# Altium schematic sheet 12V_9V_Power_Stage.SchDoc (part 1 of 4)
size 431 x 279 mm; Organization: ORGANIZATION; Address1: ADDRESS 1; Address2: ADDRESS 2; Address3: ADDRESS 3; Address4: ADDRESS 4; Revision: -; SheetNumber: 4; SheetTotal: 6; ENG_APP_DATE: --/--/--; DSN_APP_DATE: --/--/--; CHK_APP_DATE: --/--/--
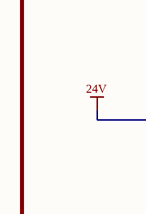
[diagram p0: 12V_9V_Power_Stage.SchDoc, left]
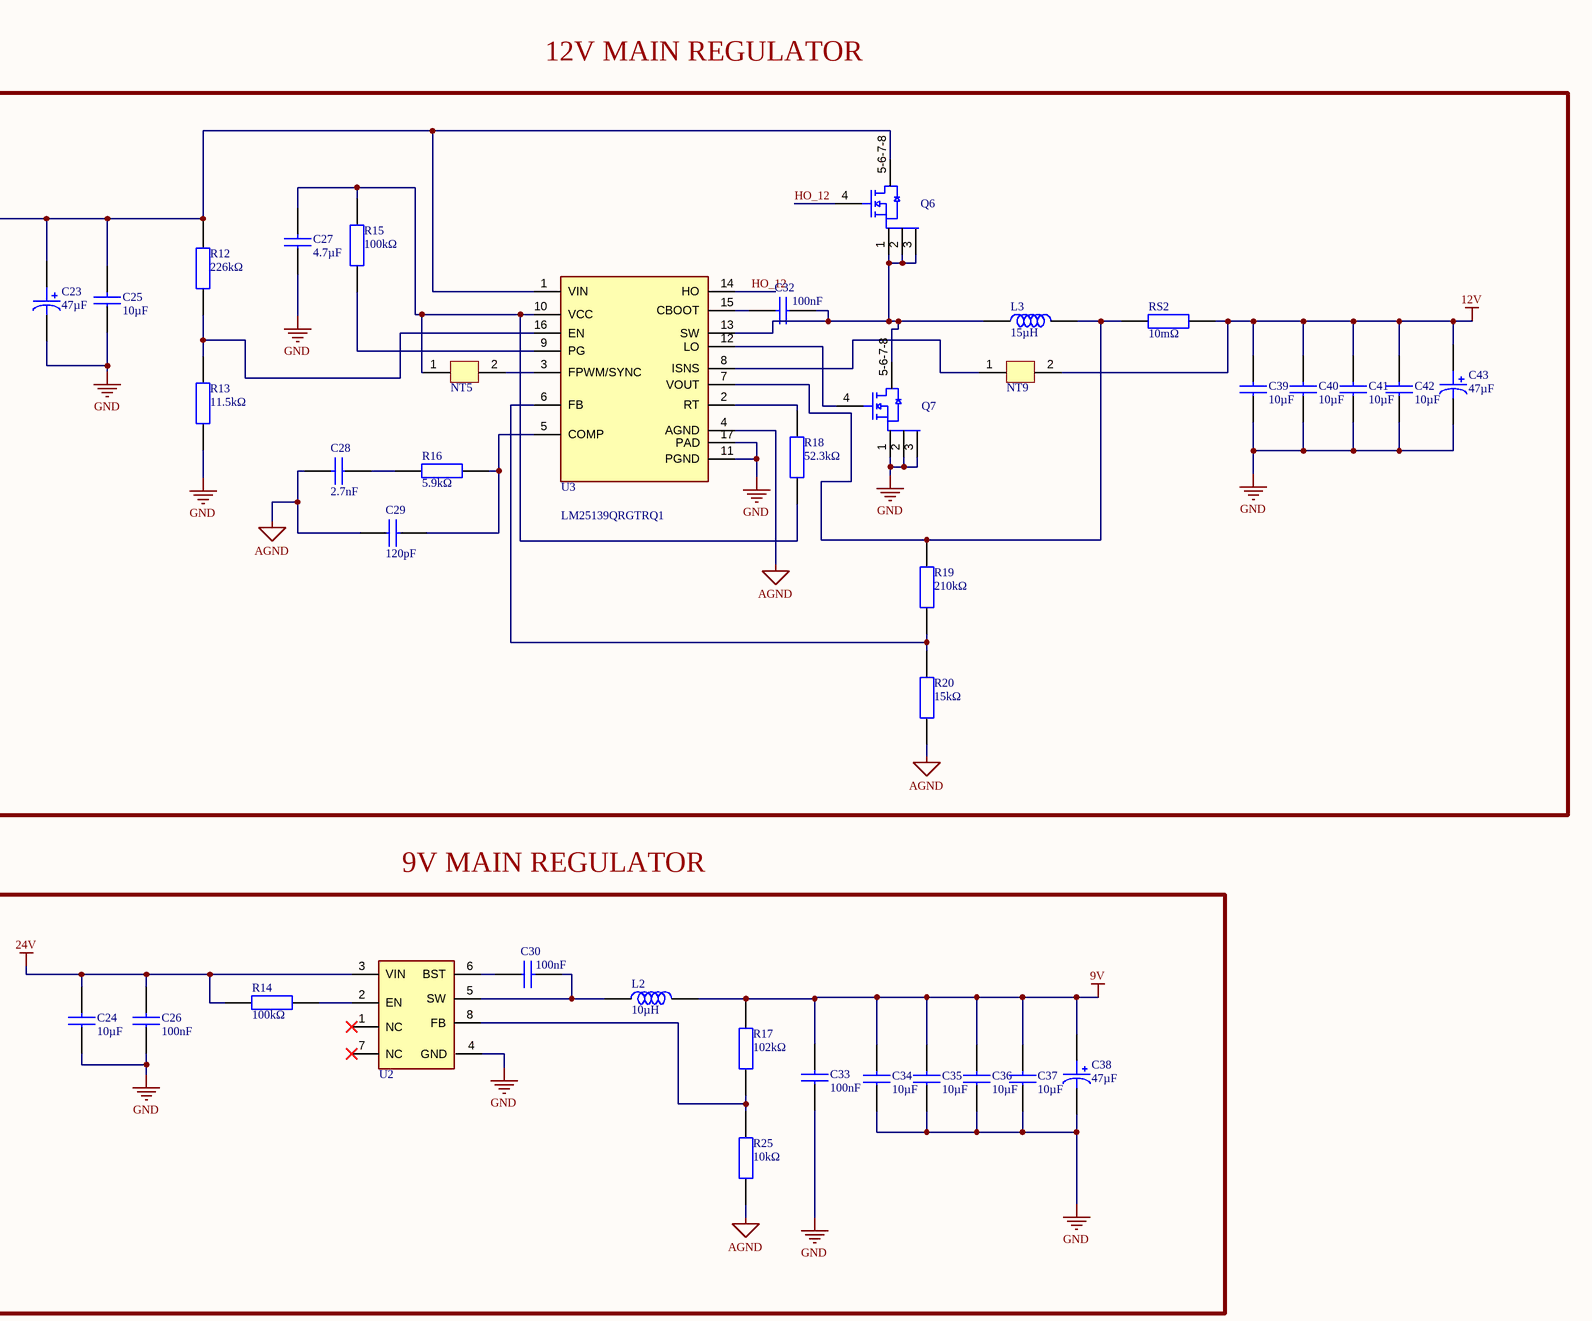
[diagram p1: 12V_9V_Power_Stage.SchDoc, right]

## Parts
C23  value 47µF  [CAP ALUM SMD]  (hidden comment: EEHZA1H470P)
C24  value 10µF  [CAP_1210_S]  (hidden comment: CL32A106KBJNNNE)
C25  value 10µF  [CAP_1206]  (hidden comment: C3216X7R1H106K160AC)
C26  value 100nF  [CAP_0603]  (hidden comment: CGA3E2X7R1H104K080AA)
C27  value 4.7µF  [CAP_0805]  (hidden comment: LMK212B7475KG-T)
C28  value 2.7nF  [CAP_0603]  (hidden comment: GRM1885C1H272JA01J)
C29  value 120pF  [CAP_0402]  (hidden comment: UMK105CG121JV-F)
C30  value 100nF  [CAP_0402]  (hidden comment: C0603X5R1A104K030BC)
C32  value 100nF  [CAP_0402]  (hidden comment: GRM155R71A104KA01D)
C33  value 100nF  [CAP_0603]  (hidden comment: CGA3E2X7R1H104K080AA)
C34  value 10µF  [CAP_1206]  (hidden comment: GRM31CR71E106KA12L)
C35  value 10µF  [CAP_1206]  (hidden comment: GRM31CR71E106KA12L)
C36  value 10µF  [CAP_1206]  (hidden comment: GRM31CR71E106KA12L)
C37  value 10µF  [CAP_1206]  (hidden comment: GRM31CR71E106KA12L)
C38  value 47µF  [CAP ALUM SMD]  (hidden comment: EEHZA1H470P)
C39  value 10µF  [CAP_1206]  (hidden comment: GRM31CR71E106KA12L)
C40  value 10µF  [CAP_1206]  (hidden comment: GRM31CR71E106KA12L)
C41  value 10µF  [CAP_1206]  (hidden comment: GRM31CR71E106KA12L)
C42  value 10µF  [CAP_1206]  (hidden comment: GRM31CR71E106KA12L)
C43  value 47µF  [CAP ALUM SMD]  (hidden comment: EEHZA1H470P)
L2  value 10µH  [SRR1208]  (hidden comment: SRR1208-100ML)
L3  value 15µH  [MSS1210]  (hidden comment: MSS1210-153MED)
NT5  Net-Tie  [Net-Tie]  (value not drawn)  (net tie, no BOM)
NT9  Net-Tie  [Net-Tie]  (value not drawn)  (net tie, no BOM)
Q6  CSD18540Q5B  [SON 5X6]  (value not drawn)
Q7  CSD18540Q5B  [SON 5X6]  (value not drawn)
R12  value 226kΩ  [RES_0402]  (hidden comment: CRCW0402226KFKED)
R13  value 11.5kΩ  [RES_0402]  (hidden comment: CRCW040211K5FKED)
R14  value 100kΩ  [RES_0603]  (hidden comment: CRCW0603100KFKEA)
R15  value 100kΩ  [RES_0603]  (hidden comment: CRCW0603100KFKEA)
R16  value 5.9kΩ  [RES_0402]  (hidden comment: CRCW04025K90FKED)
R17  value 102kΩ  [RES_0402]  (hidden comment: CRCW0402102KFKED)
R18  value 52.3kΩ  [RES_0603]  (hidden comment: CRCW060352K3FKEA)
R19  value 210kΩ  [RES_0402]  (hidden comment: CRCW0402210KFKED)
R20  value 15kΩ  [RES_0402]  (hidden comment: CRCW040215K0FKED)
R25  value 10kΩ  [RES_0402]  (hidden comment: CRCW040210K0FKED)
RS2  value 10mΩ  [CAP_1206]  (hidden comment: CSR1206FK10L0)
U2  TPS563300DRLR  [SOT-583-8]  (value not drawn)
U3  LM25139QRGTRQ1  [16-VFQFN]

## Blocks framed on the sheet
9V MAIN REGULATOR: C24 C26 C30 C33-C38 L2 R14 R17 R25 U2

## Nets
9V: C33.2 C34.2 C35.2 C36.2 C37.2 C38.1(C) L2.2 R17.2
12V: C39.2 C40.2 C41.2 C42.2 C43.1(C) NT9.2 RS2.2
24V: C23.1(C) C24.2 C25.2 C26.2 Q6.5-6-7-8(D) R12.2 R14.1 U2.3(VIN) U3.1(VIN)
AGND: C28.2 C29.1 R20.1 R25.1 U3.4(AGND)
GND: C23.2(A) C24.1 C25.1 C26.1 C27.1 C33.1 C34.1 C35.1 C36.1 C37.1 C38.2(A) C39.1 C40.1 C41.1 C42.1 C43.2(A) Q7.1(S) Q7.2(S) Q7.3(S) R13.1 U2.4(GND) U3.11(PGND) U3.17(PAD)
HO_12: Q6.4(G) U3.14(HO)
NetC27_2: C27.2 NT5.1 R15.2 R18.1 U3.10(VCC)
NetC28_1: C28.1 R16.1
NetC29_2: C29.2 R16.2 U3.5(COMP)
NetC30_1: C30.1 U2.6(BST)
NetC30_2: C30.2 L2.1 U2.5(SW)
NetC32_1: C32.1 L3.1 Q6.1(S) Q6.2(S) Q6.3(S) Q7.5-6-7-8(D) U3.13(SW)
NetC32_2: C32.2 U3.15(CBOOT)
NetL3_2: L3.2 R19.2 RS2.1 U3.7(VOUT)
NetNT5_2: NT5.2 U3.3(FPWM/SYNC)
NetNT9_1: NT9.1 U3.8(ISNS)
NetQ7_4: Q7.4(G) U3.12(LO)
NetR12_1: R12.1 R13.2 U3.16(EN)
NetR14_2: R14.2 U2.2(EN)
NetR15_1: R15.1 U3.9(PG)
NetR17_1: R17.1 R25.2 U2.8(FB)
NetR18_2: R18.2 U3.2(RT)
NetR19_1: R19.1 R20.2 U3.6(FB)

Not connected (* = marked no-connect by the designer): U2 1(NC)* 7(NC)*

## Notes on the sheet
- 12V MAIN REGULATOR
- DWG. NO.
- REV.
- SHT.
- THIS DOCUMENT AND THE DATA DISCLOSED HEREIN OR HEREWITH IS THE PROPERTY OF ALTIUM LIMITED AND MAY BE FREELY DISTRIBUTED IN WHOLE. NO RIGHTS ARE RESERVED OR EXPRESS OR IMPLIED WARANTEE GIVEN.
- REVISION
- DESCRIPTION
- DATE
- APPROVED
- ENG:
- DSN:
- APPROVALS
- PROJECT REVISION:
- www.altium.com <http://www.altium.com>
- DOCUMENT REVISION:
- 92037, La Jolla
- USA
- Altium Ltd.
- 4225 Executive Square
- CHK:
- REFERENCE DOCUMENTS
- DESIGN ITEM:
- TITLE
- VARIANT
- BOM:
- FAB DWG:
- PCB DWG:
- ASSY DWG:
- SCALE:
- SIZE
- B
- CAGE CODE
- FILE NAME
- DWG NO.
- SHEET
- OF
- REV
## Library data of the parts
C23 C38 C43 = EEHZA1H470P: Conductive Polymer Hybrid Aluminum Electrolytic Capacitors, 47µF, 50V, -55 to 105¡C; Manufacturer: Panasonic; Manufacturer Part Number: EEH-ZA1H470P; Manufacturer Lifecycle Status: ACTIVE; Part Series: ZA (High temp. reflow); ESR (Equivalent Series Resistance): 30mΩ; Leakage Current: 23.5µA; Life (Hours): 10000hours; Ripple Current: 1.8A; Tolerance: 20%; Supplier: Farnell; Supplier Part Number: EEHZA1H470P; RoHS: Compliant; Category: Aluminum Electrolytic Capacitors; Stock: 93; Pricing: 1=1,14, 10=0,637, 50=0,607, 100=0,576, 200=0,528, 500=0,479 (EUR); Case/Package: 3333; Country of Origin: Japan; Diameter: 8mm; Export Control Classification Number (ECCN) Code: EAR99; Height: 10.2mm; Harmonized Tariff Schedule (HTS) Code: 8532.22.00.20; Introduction Date: 2019-05-31; Length: 10.2mm; Lifecycle Status: Production; Material: Polymer; Max Operating Temperature: 105°C; Min Operating Temperature: -55°C; Mounting Technology: Surface Mount; Number of Terminals: 2; Ratings: AEC-Q200; REACH SVHC: Yes; Voltage Rating: 50V; Voltage Rating (DC): 50V; Width: 8.3mm; ComponentLink1URL: https://datasheet.octopart.com:443/EEH-ZA1H470P-Panasonic-datasheet-68301292.pdf?src-supplier=Panasonic; ComponentLink1Description: https://datasheet.octopart.com:443/EEH-ZA1H470P-Panasonic-datasheet-68301292.pdf?src-supplier=Panasonic; ComponentLink2URL: https://datasheet.octopart.com:443/EEH-ZA1H470P-Panasonic-datasheet-136612405.pdf?src-supplier=Electro+Sonic; ComponentLink2Description: https://datasheet.octopart.com:443/EEH-ZA1H470P-Panasonic-datasheet-136612405.pdf?src-supplier=Electro+Sonic; ComponentLink3URL: https://datasheet.octopart.com:443/EEHZA1H470P-Panasonic-datasheet-137675046.pdf?src-supplier=TME; ComponentLink3Description: https://datasheet.octopart.com:443/EEHZA1H470P-Panasonic-datasheet-137675046.pdf?src-supplier=TME
C24 = CL32A106KBJNNNE: 50V 10uF X5R 卤10% 1210 Multilayer Ceramic Capacitors MLCC - SMD/SMT ROHS; Manufacturer: Samsung Electro-Mechanics; Manufacturer Package Identifier: 1210 (3225 Metric); Tolerance: 10%; Supplier: Future Electronics; Supplier Part Number: CL32A106KBJNNNE; Manufacturer Part Number: CL32A106KBJNNNE; RoHS: Compliant; Category: Ceramic Capacitors; Stock: 186000; Pricing: 1000=0,11, 3000=0,107, 10000=0,105, 15000=0,103 (USD); Case/Package: 1210; Case Code (Imperial): 1210; Case Code (Metric): 3225; China RoHS: Compliant; Country of Origin: Mainland China, Philippines, South Korea; Depth: 2.5mm; Dielectric: X5R; Dielectric Material: Ceramic; Export Control Classification Number (ECCN) Code: EAR99; Height: 2.5mm; Harmonized Tariff Schedule (HTS) Code: 8532.24.00.20; Introduction Date: 2012-02-17; Lead Free: Lead Free; Length: 3.2mm; Lifecycle Status: Production; Material: Ceramic; Max Operating Temperature: 85°C; Min Operating Temperature: -55°C; Mounting Technology: Surface Mount; Number of Terminals: 2; Packaging: Tape & Reel (TR); REACH SVHC: Yes; Schedule B: 8532240020, 8532240020|8532240020|8532240020|8532240020|8532240020|8532240020|8532240020|8532240020|8532240020|8532240020|8532240020|8532240020|8532240020|8532240020|8532240020|8532240020|8532240020|8532240020|8532240020|8532240020|8532240020|8532240020|8532240020|85; Thickness: 2.6924mm; Voltage Rating: 50V; Voltage Rating (DC): 50V; Width: 2.5mm; ComponentLink1URL: https://datasheet.octopart.com:443/CL32A106KBJNNNE-Samsung-Electro-Mechanics-datasheet-141348239.pdf?src-supplier=Newark; ComponentLink1Description: https://datasheet.octopart.com:443/CL32A106KBJNNNE-Samsung-Electro-Mechanics-datasheet-141348239.pdf?src-supplier=Newark; ComponentLink2URL: https://datasheet.octopart.com:443/CL32A106KBJNNNE-Samsung-Electro-Mechanics-datasheet-136482658.pdf?src-supplier=Newark; ComponentLink2Description: https://datasheet.octopart.com:443/CL32A106KBJNNNE-Samsung-Electro-Mechanics-datasheet-136482658.pdf?src-supplier=Newark; ComponentLink3URL: https://datasheet.octopart.com:443/CL32A106KBJNNNE-Samsung-Electro-Mechanics-datasheet-149047602.pdf?src-supplier=Future+Electronics; ComponentLink3Description: https://datasheet.octopart.com:443/CL32A106KBJNNNE-Samsung-Electro-Mechanics-datasheet-149047602.pdf?src-supplier=Future+Electronics; ComponentLink4URL: https://datasheet.octopart.com:443/CL32A106KBJNNNE-Samsung-Electro-Mechanics-datasheet-67210002.pdf?src-supplier=Future+Electronics; ComponentLink4Description: https://datasheet.octopart.com:443/CL32A106KBJNNNE-Samsung-Electro-Mechanics-datasheet-67210002.pdf?src-supplier=Future+Electronics; ComponentLink5URL: https://datasheet.octopart.com:443/CL32A106KBJNNNE-Samsung-datasheet-58577986.pdf?src-supplier=Future+Electronics; ComponentLink5Description: https://datasheet.octopart.com:443/CL32A106KBJNNNE-Samsung-datasheet-58577986.pdf?src-supplier=Future+Electronics; ComponentLink6URL: https://datasheet.octopart.com:443/CL32A106KBJNNNE-Samsung-datasheet-37081328.pdf?src-supplier=Future+Electronics; ComponentLink6Description: https://datasheet.octopart.com:443/CL32A106KBJNNNE-Samsung-datasheet-37081328.pdf?src-supplier=Future+Electronics; ComponentLink7URL: https://datasheet.octopart.com/CL32A106KBJNNNE-Samsung-Electro-Mechanics-datasheet-97040617.pdf; ComponentLink7Description: https://datasheet.octopart.com/CL32A106KBJNNNE-Samsung-Electro-Mechanics-datasheet-97040617.pdf; ComponentLink8URL: https://datasheet.octopart.com/CL32A106KBJNNNE-Samsung-Electro-Mechanics-datasheet-8324245.pdf; ComponentLink8Description: https://datasheet.octopart.com/CL32A106KBJNNNE-Samsung-Electro-Mechanics-datasheet-8324245.pdf; ComponentLink9URL: https://datasheet.octopart.com:443/CL32A106KBJNNNE-Samsung-datasheet-8326407.pdf?src-supplier=TME; ComponentLink9Description: https://datasheet.octopart.com:443/CL32A106KBJNNNE-Samsung-datasheet-8326407.pdf?src-supplier=TME
C25 = C3216X7R1H106K160AC: 50V 10uF X7R 卤10% 1206 Multilayer Ceramic Capacitors MLCC - SMD/SMT ROHS; Manufacturer: TDK; Manufacturer Lifecycle Status: PRODUCTION; Supplier: Farnell; Supplier Part Number: C3216X7R1H106K160AC; Manufacturer Part Number: C3216X7R1H106K160AC; RoHS: Compliant; Category: Ceramic Capacitors; Stock: 6363; Pricing: 5=0,77, 50=0,378, 250=0,344, 500=0,286, 1000=0,268, 2000=0,259 (EUR); Case/Package: 1206; Case Code (Metric): 3216; China RoHS: Compliant; Dielectric: X7R; Dielectric Material: Ceramic; Export Control Classification Number (ECCN) Code: EAR99; Height: 1.6mm; Harmonized Tariff Schedule (HTS) Code: 8532.24.00.20; Introduction Date: 2018-03-29; Lead Free: Lead Free; Length: 3.2mm; Lifecycle Status: Production; Material: Ceramic; Max Length: 3.5mm; Max Operating Temperature: 125°C; Max Width: 1.9mm; Min Length: 3.1mm; Min Operating Temperature: -55°C; Min Width: 1.5mm; Mounting Technology: Surface Mount; Number of Terminals: 2; REACH SVHC: Yes; Schedule B: 8532240020, 8532240020|8532240020|8532240020|8532240020|8532240020; Thickness: 1.6mm; Voltage Rating: 50V; Voltage Rating (DC): 50V; Width: 1.6mm; ComponentLink1URL: https://datasheet.octopart.com:443/C3216X7R1H106K160AC-TDK-datasheet-175423548.pdf?src-supplier=TME; ComponentLink1Description: https://datasheet.octopart.com:443/C3216X7R1H106K160AC-TDK-datasheet-175423548.pdf?src-supplier=TME; ComponentLink2URL: https://datasheet.octopart.com:443/C3216X7R1H106K160AC-TDK-datasheet-182135025.pdf?src-supplier=TME; ComponentLink2Description: https://datasheet.octopart.com:443/C3216X7R1H106K160AC-TDK-datasheet-182135025.pdf?src-supplier=TME; ComponentLink3URL: https://datasheet.octopart.com:443/C3216X7R1H106K160AC-TDK-datasheet-159617022.pdf?src-supplier=TME; ComponentLink3Description: https://datasheet.octopart.com:443/C3216X7R1H106K160AC-TDK-datasheet-159617022.pdf?src-supplier=TME; ComponentLink4URL: https://datasheet.octopart.com:443/C3216X7R1H106K160AC-TDK-datasheet-151546523.pdf?src-supplier=ODG+(Origin+Data+Global); ComponentLink4Description: https://datasheet.octopart.com:443/C3216X7R1H106K160AC-TDK-datasheet-151546523.pdf?src-supplier=ODG+(Origin+Data+Global); ComponentLink5URL: https://datasheet.octopart.com/C3216X7R1H106K160AC-TDK-datasheet-41194876.pdf; ComponentLink5Description: https://datasheet.octopart.com/C3216X7R1H106K160AC-TDK-datasheet-41194876.pdf; ComponentLink6URL: https://datasheet.octopart.com/C-Series-Ceramic-Chip-Capacitors-TDK-datasheet-family-84.pdf; ComponentLink6Description: https://datasheet.octopart.com/C-Series-Ceramic-Chip-Capacitors-TDK-datasheet-family-84.pdf; ComponentLink7URL: http://sigma.octopart.com:80/rohs_certificate/C-Series-Ceramic-Chip-Capacitors-TDK-family-108.pdf?src-supplier=Compliance+Statements; ComponentLink7Description: http://sigma.octopart.com:80/rohs_certificate/C-Series-Ceramic-Chip-Capacitors-TDK-family-108.pdf?src-supplier=Compliance+Statements
C26 C33 = CGA3E2X7R1H104K080AA: CGA Series 0603 100 nF 50 V ±10 % Tolerance X7R SMT Multilayer Ceramic Capacitor; Manufacturer: TDK; Manufacturer Lifecycle Status: PRODUCTION; Tolerance: 10%; Voltage: 50V; Supplier: Farnell; Supplier Part Number: CGA3E2X7R1H104K080AA; Manufacturer Part Number: CGA3E2X7R1H104K080AA; RoHS: Compliant; Category: Ceramic Capacitors; Stock: 155038; Pricing: 10=0,0336, 100=0,0286, 500=0,0215, 1000=0,0184, 2000=0,0173 (EUR); Case/Package: 0603; Case Code (Imperial): 0603; Case Code (Metric): 1608; China RoHS: Compliant; Composition: Ceramic; Depth: 800µm; Dielectric: X7R; Dielectric Material: Ceramic; Height: 800µm; Lead Free: Lead Free; Length: 1.6mm; Lifecycle Status: Production; Material: Ceramic; Max Length: 1.7mm; Max Operating Temperature: 125°C; Max Width: 900µm; Min Length: 1.5mm; Min Operating Temperature: -55°C; Min Width: 700µm; Mounting Technology: Surface Mount; Number of Terminals: 2; Radiation Hardening: No; Ratings: AEC-Q200; REACH SVHC: Yes; Schedule B: 8532240020, 8532240020|8532240020|8532240020|8532240020|8532240020; Termination: SMD/SMT; Thickness: 889µm; Voltage Rating: 50V; Voltage Rating (DC): 50V; Weight: 2.012816mg; Width: 800µm; ComponentLink1URL: https://datasheet.octopart.com:443/CGA3E2X7R1H104K080AA-TDK-datasheet-165583812.pdf?src-supplier=IHS; ComponentLink1Description: https://datasheet.octopart.com:443/CGA3E2X7R1H104K080AA-TDK-datasheet-165583812.pdf?src-supplier=IHS; ComponentLink2URL: https://datasheet.octopart.com:443/CGA3E2X7R1H104K080AA-TDK-datasheet-138890726.pdf?src-supplier=Upverter; ComponentLink2Description: https://datasheet.octopart.com:443/CGA3E2X7R1H104K080AA-TDK-datasheet-138890726.pdf?src-supplier=Upverter; ComponentLink3URL: https://datasheet.octopart.com:443/CGA3E2X7R1H104K080AA-TDK-datasheet-43457115.pdf?src-supplier=Upverter; ComponentLink3Description: https://datasheet.octopart.com:443/CGA3E2X7R1H104K080AA-TDK-datasheet-43457115.pdf?src-supplier=Upverter; ComponentLink4URL: https://datasheet.octopart.com:443/CGA3E2X7R1H104K080AA-TDK-datasheet-151546526.pdf?src-supplier=ODG+(Origin+Data+Global); ComponentLink4Description: https://datasheet.octopart.com:443/CGA3E2X7R1H104K080AA-TDK-datasheet-151546526.pdf?src-supplier=ODG+(Origin+Data+Global); ComponentLink5URL: https://datasheet.octopart.com:443/CGA3E2X7R1H104K080AA-TDK-datasheet-43366117.pdf?src-supplier=Newark; ComponentLink5Description: https://datasheet.octopart.com:443/CGA3E2X7R1H104K080AA-TDK-datasheet-43366117.pdf?src-supplier=Newark; ComponentLink6URL: https://datasheet.octopart.com:443/CGA3E2X7R1H104K080AA-TDK-datasheet-23766614.pdf?src-supplier=Newark; ComponentLink6Description: https://datasheet.octopart.com:443/CGA3E2X7R1H104K080AA-TDK-datasheet-23766614.pdf?src-supplier=Newark; ComponentLink7URL: https://datasheet.octopart.com:443/CGA3E2X7R1H104K080AA-TDK-datasheet-13444418.pdf?src-supplier=Newark; ComponentLink7Description: https://datasheet.octopart.com:443/CGA3E2X7R1H104K080AA-TDK-datasheet-13444418.pdf?src-supplier=Newark; ComponentLink8URL: https://datasheet.octopart.com:443/CGA3E2X7R1H104K080AA.-TDK-datasheet-159510193.pdf?src-supplier=Newark; ComponentLink8Description: https://datasheet.octopart.com:443/CGA3E2X7R1H104K080AA.-TDK-datasheet-159510193.pdf?src-supplier=Newark; ComponentLink9URL: https://datasheet.octopart.com:443/CGA3E2X7R1H104K080AA-TDK-datasheet-136412745.pdf?src-supplier=element14+APAC; ComponentLink9Description: https://datasheet.octopart.com:443/CGA3E2X7R1H104K080AA-TDK-datasheet-136412745.pdf?src-supplier=element14+APAC; ComponentLink10URL: https://datasheet.octopart.com:443/CGA3E2X7R1H104K080AA-TDK-datasheet-21217900.pdf?src-supplier=Farnell; ComponentLink10Description: https://datasheet.octopart.com:443/CGA3E2X7R1H104K080AA-TDK-datasheet-21217900.pdf?src-supplier=Farnell; ComponentLink11URL: https://datasheet.octopart.com:443/CGA3E2X7R1H104K080AA-TDK-datasheet-164882302.pdf?src-supplier=Burklin+Elektronik; ComponentLink11Description: https://datasheet.octopart.com:443/CGA3E2X7R1H104K080AA-TDK-datasheet-164882302.pdf?src-supplier=Burklin+Elektronik; ComponentLink12URL: https://datasheet.octopart.com:443/CGA3E2X7R1H104K080AA-TDK-datasheet-13234200.pdf?src-supplier=Future+Electronics; ComponentLink12Description: https://datasheet.octopart.com:443/CGA3E2X7R1H104K080AA-TDK-datasheet-13234200.pdf?src-supplier=Future+Electronics; ComponentLink13URL: https://datasheet.octopart.com:443/CGA3E2X7R1H104K080AA-TDK-datasheet-12527010.pdf?src-supplier=Future+Electronics; ComponentLink13Description: https://datasheet.octopart.com:443/CGA3E2X7R1H104K080AA-TDK-datasheet-12527010.pdf?src-supplier=Future+Electronics; ComponentLink14URL: https://datasheet.octopart.com:443/CGA3E2X7R1H104K080AA-TDK-datasheet-140571036.pdf?src-supplier=Arrow.cn; ComponentLink14Description: https://datasheet.octopart.com:443/CGA3E2X7R1H104K080AA-TDK-datasheet-140571036.pdf?src-supplier=Arrow.cn
C27 = LMK212B7475KG-T: 10V 4.7uF X7R ±10% 0805 Multilayer Ceramic Capacitors MLCC - SMD/SMT ROHS; Manufacturer: TAIYO YUDEN; Manufacturer Package Identifier: 0805 (2012 metric); Supplier: Future Electronics; Supplier Part Number: LMK212B7475KG-T; Manufacturer Part Number: LMK212B7475KG-T; RoHS: Compliant; Category: Ceramic Capacitors; Stock: 486000; Pricing: 3000=0,0271, 9000=0,0264, 15000=0,0261, 30000=0,0257, 60000=0,025 (USD); Case/Package: 0805; Case Code (Imperial): 0805; Case Code (Metric): 2012; Country of Origin: Japan, Mainland China, Malaysia, South Korea; Dielectric: X7R; Dielectric Material: Ceramic; Export Control Classification Number (ECCN) Code: EAR99; Halogen Free: Halogen Free; Height: 1.25mm; Harmonized Tariff Schedule (HTS) Code: 8532.24.00.20; Introduction Date: 2008-08-30; Length: 2mm; Lifecycle Status: Production; LTB Date: 2026-03-31; LTD Date: 2026-03-31; Material: Ceramic; Max Length: 2.1mm; Max Operating Temperature: 125°C; Max Thickness: 1.35mm; Max Width: 1.35mm; Min Length: 1.9mm; Min Operating Temperature: -55°C; Min Thickness: 1.15mm; Min Width: 1.15mm; Mounting Technology: Surface Mount; Pins: 2; Number of Terminals: 2; REACH SVHC: Yes; Schedule B: 8532240020; Termination: SMD/SMT; Thickness: 1.3462mm; Tolerance: 10%; Voltage Rating: 10V; Voltage Rating (DC): 10V; Width: 1.25mm; ComponentLink1URL: https://datasheet.octopart.com:443/LMK212B7475KG-T-Taiyo-Yuden-datasheet-182109618.pdf?src-supplier=IHS; ComponentLink1Description: https://datasheet.octopart.com:443/LMK212B7475KG-T-Taiyo-Yuden-datasheet-182109618.pdf?src-supplier=IHS; ComponentLink2URL: https://datasheet.octopart.com:443/LMK212B7475KG-T-Taiyo-Yuden-datasheet-99833425.pdf?src-supplier=Upverter; ComponentLink2Description: https://datasheet.octopart.com:443/LMK212B7475KG-T-Taiyo-Yuden-datasheet-99833425.pdf?src-supplier=Upverter; ComponentLink3URL: https://datasheet.octopart.com:443/LMK212B7475KG-T-Taiyo-Yuden-datasheet-10851928.pdf?src-supplier=Farnell; ComponentLink3Description: https://datasheet.octopart.com:443/LMK212B7475KG-T-Taiyo-Yuden-datasheet-10851928.pdf?src-supplier=Farnell; ComponentLink4URL: https://datasheet.octopart.com:443/LMK212B7475KG-T-Taiyo-Yuden-datasheet-10254988.pdf?src-supplier=Farnell; ComponentLink4Description: https://datasheet.octopart.com:443/LMK212B7475KG-T-Taiyo-Yuden-datasheet-10254988.pdf?src-supplier=Farnell; ComponentLink5URL: https://datasheet.octopart.com:443/LMK212B7475KG-T-Taiyo-Yuden-datasheet-154807926.pdf?src-supplier=JRH+Electronics; ComponentLink5Description: https://datasheet.octopart.com:443/LMK212B7475KG-T-Taiyo-Yuden-datasheet-154807926.pdf?src-supplier=JRH+Electronics; ComponentLink6URL: https://datasheet.octopart.com:443/LMK212B7475KG-T-Taiyo-Yuden-datasheet-159617013.pdf?src-supplier=Newark; ComponentLink6Description: https://datasheet.octopart.com:443/LMK212B7475KG-T-Taiyo-Yuden-datasheet-159617013.pdf?src-supplier=Newark; ComponentLink7URL: https://datasheet.octopart.com:443/LMK212B7475KG-T-Taiyo-Yuden-datasheet-65850919.pdf?src-supplier=Newark; ComponentLink7Description: https://datasheet.octopart.com:443/LMK212B7475KG-T-Taiyo-Yuden-datasheet-65850919.pdf?src-supplier=Newark; ComponentLink8URL: https://datasheet.octopart.com:443/LMK212B7475KG-T-Taiyo-Yuden-datasheet-8857305.pdf?src-supplier=Newark; ComponentLink8Description: https://datasheet.octopart.com:443/LMK212B7475KG-T-Taiyo-Yuden-datasheet-8857305.pdf?src-supplier=Newark; ComponentLink9URL: https://datasheet.octopart.com:443/LMK212B7475KG-T-Taiyo-Yuden-datasheet-8434558.pdf?src-supplier=Newark; ComponentLink9Description: https://datasheet.octopart.com:443/LMK212B7475KG-T-Taiyo-Yuden-datasheet-8434558.pdf?src-supplier=Newark; ComponentLink10URL: https://datasheet.octopart.com:443/LMK212B7475KG-T-Taiyo-Yuden-datasheet-140424376.pdf?src-supplier=Master+Electronics; ComponentLink10Description: https://datasheet.octopart.com:443/LMK212B7475KG-T-Taiyo-Yuden-datasheet-140424376.pdf?src-supplier=Master+Electronics; ComponentLink11URL: https://datasheet.octopart.com/LMK212B7475KG-T-Taiyo-Yuden-datasheet-13694806.pdf; ComponentLink11Description: https://datasheet.octopart.com/LMK212B7475KG-T-Taiyo-Yuden-datasheet-13694806.pdf; ComponentLink12URL: https://datasheet.octopart.com:443/LMK212B7475KG-T-Taiyo-Yuden-datasheet-11762034.pdf?src-supplier=element14+APAC; ComponentLink12Description: https://datasheet.octopart.com:443/LMK212B7475KG-T-Taiyo-Yuden-datasheet-11762034.pdf?src-supplier=element14+APAC; ComponentLink13URL: https://datasheet.octopart.com:443/LMK212B7475KG-T-Taiyo-Yuden-datasheet-138738940.pdf?src-supplier=Taiyo+Yuden+SCT; ComponentLink13Description: https://datasheet.octopart.com:443/LMK212B7475KG-T-Taiyo-Yuden-datasheet-138738940.pdf?src-supplier=Taiyo+Yuden+SCT; ComponentLink14URL: https://datasheet.octopart.com:443/LMK212B7475KG-T-Taiyo-Yuden-datasheet-99784816.pdf?src-supplier=Future+Electronics; ComponentLink14Description: https://datasheet.octopart.com:443/LMK212B7475KG-T-Taiyo-Yuden-datasheet-99784816.pdf?src-supplier=Future+Electronics; ComponentLink15URL: https://datasheet.octopart.com:443/LMK212B7475KG-T-Taiyo-Yuden-datasheet-99833418.pdf?src-supplier=Future+Electronics; ComponentLink15Description: https://datasheet.octopart.com:443/LMK212B7475KG-T-Taiyo-Yuden-datasheet-99833418.pdf?src-supplier=Future+Electronics; ComponentLink16URL: https://datasheet.octopart.com:443/LMK212B7475KG-T-Taiyo-Yuden-datasheet-62109503.pdf?src-supplier=Electro+Sonic; ComponentLink16Description: https://datasheet.octopart.com:443/LMK212B7475KG-T-Taiyo-Yuden-datasheet-62109503.pdf?src-supplier=Electro+Sonic; ComponentLink17URL: https://datasheet.octopart.com:443/LMK212B7475KG-T-Taiyo-Yuden-datasheet-41181457.pdf?src-supplier=Electro+Sonic; ComponentLink17Description: https://datasheet.octopart.com:443/LMK212B7475KG-T-Taiyo-Yuden-datasheet-41181457.pdf?src-supplier=Electro+Sonic; ComponentLink18URL: https://datasheet.octopart.com:443/LMK212B7475KG-T-Taiyo-Yuden-datasheet-14433612.pdf?src-supplier=Factory+Futures; ComponentLink18Description: https://datasheet.octopart.com:443/LMK212B7475KG-T-Taiyo-Yuden-datasheet-14433612.pdf?src-supplier=Factory+Futures
C28 = GRM1885C1H272JA01J: 0603 2.7 nF 50 V ±5% Tolerance C0G SMT Multilayer Ceramic Capacitor; Manufacturer: Murata; Manufacturer Lifecycle Status: IN PRODUCTION; Temperature Coefficient: 30ppm/°C; Voltage Rating: 50V; Supplier: Arrow Electronics; Supplier Part Number: GRM1885C1H272JA01J; Manufacturer Part Number: GRM1885C1H272JA01J; RoHS: Compliant; Category: Ceramic Capacitors; Stock: 5058; Pricing: 1=0,004, 10=0,0037, 25=0,0033, 100=0,003, 250=0,0027, 500=0,0023, 1000=0,002, 3000=0,0017 (USD); Case/Package: 0603; Case Code (Imperial): 0603; Case Code (Metric): 1608; Depth: 800µm; Dielectric: C0G; Dielectric Material: Ceramic; Export Control Classification Number (ECCN) Code: EAR99; Height: 800µm; Harmonized Tariff Schedule (HTS) Code: 8532.24.00.20; Introduction Date: 2004-09-04; Lead Free: Lead Free; Length: 1.6mm; Lifecycle Status: Production; Material: Ceramic; Max Operating Temperature: 125°C; Min Operating Temperature: -55°C; Mounting Technology: Surface Mount; Number of Terminals: 2; Packaging: Tape & Reel; Radiation Hardening: No; REACH SVHC: Yes; Schedule B: 8532240020, 8532240020|8532240020|8532240020|8532240020|8532240020; Termination: SMD/SMT; Thickness: 800µm; Tolerance: 5%; Voltage Rating (DC): 50V; Width: 800µm; ComponentLink1URL: https://datasheet.octopart.com:443/GRM1885C1H272JA01J-Murata-datasheet-8328230.pdf?src-supplier=Future+Electronics; ComponentLink1Description: https://datasheet.octopart.com:443/GRM1885C1H272JA01J-Murata-datasheet-8328230.pdf?src-supplier=Future+Electronics; ComponentLink2URL: https://datasheet.octopart.com:443/GRM1885C1H272JA01J-Murata-datasheet-22122223.pdf?src-supplier=Future+Electronics; ComponentLink2Description: https://datasheet.octopart.com:443/GRM1885C1H272JA01J-Murata-datasheet-22122223.pdf?src-supplier=Future+Electronics; ComponentLink3URL: https://datasheet.octopart.com:443/GRM1885C1H272JA01J-Murata-datasheet-26530162.pdf?src-supplier=Future+Electronics; ComponentLink3Description: https://datasheet.octopart.com:443/GRM1885C1H272JA01J-Murata-datasheet-26530162.pdf?src-supplier=Future+Electronics; ComponentLink4URL: https://datasheet.octopart.com:443/GRM1885C1H272JA01J-Murata-datasheet-141274271.pdf?src-supplier=Ciiva; ComponentLink4Description: https://datasheet.octopart.com:443/GRM1885C1H272JA01J-Murata-datasheet-141274271.pdf?src-supplier=Ciiva; ComponentLink5URL: https://datasheet.octopart.com:443/GRM1885C1H272JA01J-Murata-datasheet-140696475.pdf?src-supplier=Ciiva; ComponentLink5Description: https://datasheet.octopart.com:443/GRM1885C1H272JA01J-Murata-datasheet-140696475.pdf?src-supplier=Ciiva; ComponentLink6URL: https://datasheet.octopart.com:443/GRM1885C1H272JA01J-Murata-datasheet-138741538.pdf?src-supplier=Ciiva; ComponentLink6Description: https://datasheet.octopart.com:443/GRM1885C1H272JA01J-Murata-datasheet-138741538.pdf?src-supplier=Ciiva; ComponentLink7URL: https://datasheet.octopart.com:443/GRM1885C1H272JA01J-Murata-datasheet-155239085.pdf?src-supplier=Farnell; ComponentLink7Description: https://datasheet.octopart.com:443/GRM1885C1H272JA01J-Murata-datasheet-155239085.pdf?src-supplier=Farnell; ComponentLink8URL: https://datasheet.octopart.com/GRM1885C1H272JA01J-Murata-datasheet-12515295.pdf; ComponentLink8Description: https://datasheet.octopart.com/GRM1885C1H272JA01J-Murata-datasheet-12515295.pdf; ComponentLink9URL: https://datasheet.octopart.com/GRM1885C1H272JA01J-Murata-datasheet-12510076.pdf; ComponentLink9Description: https://datasheet.octopart.com/GRM1885C1H272JA01J-Murata-datasheet-12510076.pdf; ComponentLink10URL: https://datasheet.octopart.com/GRM1885C1H272JA01J-Murata-datasheet-11978611.pdf; ComponentLink10Description: https://datasheet.octopart.com/GRM1885C1H272JA01J-Murata-datasheet-11978611.pdf; ComponentLink11URL: https://datasheet.octopart.com/GRM1885C1H272JA01J-Murata-datasheet-10025737.pdf; ComponentLink11Description: https://datasheet.octopart.com/GRM1885C1H272JA01J-Murata-datasheet-10025737.pdf; ComponentLink12URL: https://datasheet.octopart.com/GRM1885C1H272JA01J-Murata-datasheet-8819587.pdf; ComponentLink12Description: https://datasheet.octopart.com/GRM1885C1H272JA01J-Murata-datasheet-8819587.pdf; ComponentLink13URL: https://datasheet.octopart.com/GRM1885C1H272JA01J-Murata-datasheet-14397128.pdf; ComponentLink13Description: https://datasheet.octopart.com/GRM1885C1H272JA01J-Murata-datasheet-14397128.pdf; ComponentLink14URL: http://sigma.octopart.com:80/reach_statement/Murata-company-16.pdf?src-supplier=Compliance+Statements; ComponentLink14Description: http://sigma.octopart.com:80/reach_statement/Murata-company-16.pdf?src-supplier=Compliance+Statements
C29 = UMK105CG121JV-F: Multilayer Ceramic Capacitors 120pF 50V C0G 5% SMD 0402; Manufacturer: TAIYO YUDEN; Temperature Coefficient: 30ppm/°C; Supplier: Future Electronics; Supplier Part Number: UMK105CG121JV-F; Manufacturer Part Number: UMK105CG121JV-F; RoHS: Compliant; Category: Ceramic Capacitors; Stock: 10000; Pricing: 10000=0,0057, 30000=0,0055, 50000=0,0055, 150000=0,0053, 250000=0,0052 (USD); Case/Package: 0402; Case Code (Imperial): 0402; Case Code (Metric): 1005; Depth: 500µm; Dielectric: C0G; Dielectric Material: Ceramic; Halogen Free: Halogen Free; Height: 500µm; Lead Free: Lead Free; Length: 1mm; Lifecycle Status: Production; Max Length: 1.05mm; Max Operating Temperature: 125°C; Max Thickness: 550µm; Max Width: 550µm; Min Length: 950µm; Min Operating Temperature: -55°C; Min Thickness: 450µm; Min Width: 450µm; Mounting Technology: Surface Mount; Pins: 2; Number of Terminals: 2; Packaging: Cut Tape; Radiation Hardening: No; REACH SVHC: Yes; Termination: SMD/SMT; Thickness: 558.8µm; Tolerance: 5%; Voltage Rating: 50V; Voltage Rating (DC): 50V; Width: 500µm; ComponentLink1URL: https://datasheet.octopart.com:443/UMK105CG121JV-F-Taiyo-Yuden-datasheet-182134298.pdf?src-supplier=IHS; ComponentLink1Description: https://datasheet.octopart.com:443/UMK105CG121JV-F-Taiyo-Yuden-datasheet-182134298.pdf?src-supplier=IHS; ComponentLink2URL: https://datasheet.octopart.com:443/UMK105CG121JV-F-Taiyo-Yuden-datasheet-154810152.pdf?src-supplier=JRH+Electronics; ComponentLink2Description: https://datasheet.octopart.com:443/UMK105CG121JV-F-Taiyo-Yuden-datasheet-154810152.pdf?src-supplier=JRH+Electronics; ComponentLink3URL: https://datasheet.octopart.com:443/UMK105CG121JV-F-Taiyo-Yuden-datasheet-8858600.pdf?src-supplier=JRH+Electronics; ComponentLink3Description: https://datasheet.octopart.com:443/UMK105CG121JV-F-Taiyo-Yuden-datasheet-8858600.pdf?src-supplier=JRH+Electronics; ComponentLink4URL: https://datasheet.octopart.com:443/UMK105CG121JV-F-Taiyo-Yuden-datasheet-8857305.pdf?src-supplier=Newark; ComponentLink4Description: https://datasheet.octopart.com:443/UMK105CG121JV-F-Taiyo-Yuden-datasheet-8857305.pdf?src-supplier=Newark; ComponentLink5URL: https://datasheet.octopart.com:443/UMK105CG121JV-F-Taiyo-Yuden-datasheet-10851928.pdf?src-supplier=Newark; ComponentLink5Description: https://datasheet.octopart.com:443/UMK105CG121JV-F-Taiyo-Yuden-datasheet-10851928.pdf?src-supplier=Newark; ComponentLink6URL: https://datasheet.octopart.com:443/UMK105CG121JV-F-Taiyo-Yuden-datasheet-8434558.pdf?src-supplier=Newark; ComponentLink6Description: https://datasheet.octopart.com:443/UMK105CG121JV-F-Taiyo-Yuden-datasheet-8434558.pdf?src-supplier=Newark; ComponentLink7URL: https://datasheet.octopart.com:443/UMK105CG121JV-F-Taiyo-Yuden-datasheet-182874648.pdf?src-supplier=Newark; ComponentLink7Description: https://datasheet.octopart.com:443/UMK105CG121JV-F-Taiyo-Yuden-datasheet-182874648.pdf?src-supplier=Newark; ComponentLink8URL: https://datasheet.octopart.com:443/UMK105CG121JV-F-Taiyo-Yuden-datasheet-41194858.pdf?src-supplier=Newark; ComponentLink8Description: https://datasheet.octopart.com:443/UMK105CG121JV-F-Taiyo-Yuden-datasheet-41194858.pdf?src-supplier=Newark; ComponentLink9URL: https://datasheet.octopart.com:443/UMK105CG121JV-F-Taiyo-Yuden-datasheet-140473435.pdf?src-supplier=Master+Electronics; ComponentLink9Description: https://datasheet.octopart.com:443/UMK105CG121JV-F-Taiyo-Yuden-datasheet-140473435.pdf?src-supplier=Master+Electronics; ComponentLink10URL: https://datasheet.octopart.com:443/UMK105CG121JV-F-Taiyo-Yuden-datasheet-13695304.pdf?src-supplier=Farnell; ComponentLink10Description: https://datasheet.octopart.com:443/UMK105CG121JV-F-Taiyo-Yuden-datasheet-13695304.pdf?src-supplier=Farnell; ComponentLink11URL: https://datasheet.octopart.com:443/UMK105CG121JV-F-Taiyo-Yuden-datasheet-10742123.pdf?src-supplier=Farnell; ComponentLink11Description: https://datasheet.octopart.com:443/UMK105CG121JV-F-Taiyo-Yuden-datasheet-10742123.pdf?src-supplier=Farnell; ComponentLink12URL: https://datasheet.octopart.com:443/UMK105CG121JV-F-Taiyo-Yuden-datasheet-10545600.pdf?src-supplier=Farnell; ComponentLink12Description: https://datasheet.octopart.com:443/UMK105CG121JV-F-Taiyo-Yuden-datasheet-10545600.pdf?src-supplier=Farnell; ComponentLink13URL: https://datasheet.octopart.com:443/UMK105CG121JV-F-Taiyo-Yuden-datasheet-10622963.pdf?src-supplier=Farnell; ComponentLink13Description: https://datasheet.octopart.com:443/UMK105CG121JV-F-Taiyo-Yuden-datasheet-10622963.pdf?src-supplier=Farnell; ComponentLink14URL: https://datasheet.octopart.com:443/UMK105CG121JV-F-Taiyo-Yuden-datasheet-10618026.pdf?src-supplier=Farnell; ComponentLink14Description: https://datasheet.octopart.com:443/UMK105CG121JV-F-Taiyo-Yuden-datasheet-10618026.pdf?src-supplier=Farnell; ComponentLink15URL: https://datasheet.octopart.com:443/UMK105CG121JV-F-Taiyo-Yuden-datasheet-10549048.pdf?src-supplier=Farnell; ComponentLink15Description: https://datasheet.octopart.com:443/UMK105CG121JV-F-Taiyo-Yuden-datasheet-10549048.pdf?src-supplier=Farnell; ComponentLink16URL: https://datasheet.octopart.com:443/UMK105CG121JV-F-Taiyo-Yuden-datasheet-10671320.pdf?src-supplier=Farnell; ComponentLink16Description: https://datasheet.octopart.com:443/UMK105CG121JV-F-Taiyo-Yuden-datasheet-10671320.pdf?src-supplier=Farnell; ComponentLink17URL: https://datasheet.octopart.com:443/UMK105CG121JV-F-Taiyo-Yuden-datasheet-10620942.pdf?src-supplier=Farnell; ComponentLink17Description: https://datasheet.octopart.com:443/UMK105CG121JV-F-Taiyo-Yuden-datasheet-10620942.pdf?src-supplier=Farnell; ComponentLink18URL: https://datasheet.octopart.com:443/UMK105CG121JV-F-Taiyo-Yuden-datasheet-10408854.pdf?src-supplier=Farnell; ComponentLink18Description: https://datasheet.octopart.com:443/UMK105CG121JV-F-Taiyo-Yuden-datasheet-10408854.pdf?src-supplier=Farnell; ComponentLink19URL: https://datasheet.octopart.com:443/UMK105CG121JV-F-Taiyo-Yuden-datasheet-10283011.pdf?src-supplier=Farnell; ComponentLink19Description: https://datasheet.octopart.com:443/UMK105CG121JV-F-Taiyo-Yuden-datasheet-10283011.pdf?src-supplier=Farnell; ComponentLink20URL: https://datasheet.octopart.com:443/UMK105CG121JV-F-Taiyo-Yuden-datasheet-10031713.pdf?src-supplier=Farnell; ComponentLink20Description: https://datasheet.octopart.com:443/UMK105CG121JV-F-Taiyo-Yuden-datasheet-10031713.pdf?src-supplier=Farnell; ComponentLink21URL: https://datasheet.octopart.com:443/UMK105CG121JV-F-Taiyo-Yuden-datasheet-10854574.pdf?src-supplier=Farnell; ComponentLink21Description: https://datasheet.octopart.com:443/UMK105CG121JV-F-Taiyo-Yuden-datasheet-10854574.pdf?src-supplier=Farnell; ComponentLink22URL: https://datasheet.octopart.com:443/UMK105CG121JV-F-Taiyo-Yuden-datasheet-8820216.pdf?src-supplier=Farnell; ComponentLink22Description: https://datasheet.octopart.com:443/UMK105CG121JV-F-Taiyo-Yuden-datasheet-8820216.pdf?src-supplier=Farnell; ComponentLink23URL: https://datasheet.octopart.com:443/UMK105CG121JV-F-Taiyo-Yuden-datasheet-119523.pdf?src-supplier=Farnell; ComponentLink23Description: https://datasheet.octopart.com:443/UMK105CG121JV-F-Taiyo-Yuden-datasheet-119523.pdf?src-supplier=Farnell; ComponentLink24URL: https://datasheet.octopart.com:443/UMK105CG121JV-F-Taiyo-Yuden-datasheet-120265.pdf?src-supplier=Farnell; ComponentLink24Description: https://datasheet.octopart.com:443/UMK105CG121JV-F-Taiyo-Yuden-datasheet-120265.pdf?src-supplier=Farnell; ComponentLink25URL: https://datasheet.octopart.com:443/UMK105CG121JV-F-Taiyo-Yuden-datasheet-5326109.pdf?src-supplier=Farnell; ComponentLink25Description: https://datasheet.octopart.com:443/UMK105CG121JV-F-Taiyo-Yuden-datasheet-5326109.pdf?src-supplier=Farnell; ComponentLink26URL: https://datasheet.octopart.com:443/UMK105CG121JV-F-Taiyo-Yuden-datasheet-118905.pdf?src-supplier=Farnell; ComponentLink26Description: https://datasheet.octopart.com:443/UMK105CG121JV-F-Taiyo-Yuden-datasheet-118905.pdf?src-supplier=Farnell; ComponentLink27URL: https://datasheet.octopart.com:443/UMK105CG121JV-F-Taiyo-Yuden-datasheet-1645.pdf?src-supplier=Farnell; ComponentLink27Description: https://datasheet.octopart.com:443/UMK105CG121JV-F-Taiyo-Yuden-datasheet-1645.pdf?src-supplier=Farnell; ComponentLink28URL: https://datasheet.octopart.com:443/UMK105CG121JV-F-Taiyo-Yuden-datasheet-138738940.pdf?src-supplier=Taiyo+Yuden+SCT; ComponentLink28Description: https://datasheet.octopart.com:443/UMK105CG121JV-F-Taiyo-Yuden-datasheet-138738940.pdf?src-supplier=Taiyo+Yuden+SCT; ComponentLink29URL: https://datasheet.octopart.com:443/UMK105CG121JV-F-Taiyo-Yuden-datasheet-97186031.pdf?src-supplier=Future+Electronics; ComponentLink29Description: https://datasheet.octopart.com:443/UMK105CG121JV-F-Taiyo-Yuden-datasheet-97186031.pdf?src-supplier=Future+Electronics; ComponentLink30URL: https://datasheet.octopart.com/UMK105CG121JV-F-Taiyo-Yuden-datasheet-17274794.pdf; ComponentLink30Description: https://datasheet.octopart.com/UMK105CG121JV-F-Taiyo-Yuden-datasheet-17274794.pdf
C30 = C0603X5R1A104K030BC: C Series 0201 0.1 uF 10 V ±10 % Tolerance X5R SMT Multilayer Ceramic Capacitor; Manufacturer: TDK; Manufacturer Lifecycle Status: PRODUCTION; Tolerance: 10%; Voltage Rating: 10V; Supplier: Farnell; Supplier Part Number: C0603X5R1A104K030BC; Manufacturer Part Number: C0603X5R1A104K030BC; RoHS: Compliant; Category: Ceramic Capacitors; Stock: 195000; Pricing: 15000=0,0061 (EUR); Case/Package: 0201; Case Code (Imperial): 0201; Case Code (Metric): 0603; China RoHS: Compliant; Depth: 300µm; Dielectric: X5R; Dielectric Material: Ceramic; Export Control Classification Number (ECCN) Code: EAR99; Height: 300µm; Harmonized Tariff Schedule (HTS) Code: 8532.24.00.20; Introduction Date: 2012-12-22; Lead Free: Lead Free; Length: 600µm; Lifecycle Status: Production; Material: Ceramic; Max Length: 630µm; Max Operating Temperature: 85°C; Max Width: 330µm; Min Length: 570µm; Min Operating Temperature: -55°C; Min Width: 270µm; Mounting Technology: Surface Mount; Number of Terminals: 2; REACH SVHC: Yes; Schedule B: 8532240020, 8532240020|8532240020|8532240020|8532240020|8532240020; Termination: SMD/SMT; Voltage Rating (DC): 10V; Weight: 170.097139µg; Width: 300µm; ComponentLink1URL: https://datasheet.octopart.com:443/C0603X5R1A104K030BC-TDK-datasheet-158983655.pdf?src-supplier=IHS; ComponentLink1Description: https://datasheet.octopart.com:443/C0603X5R1A104K030BC-TDK-datasheet-158983655.pdf?src-supplier=IHS; ComponentLink2URL: https://datasheet.octopart.com:443/C0603X5R1A104K030BC-TDK-datasheet-151546523.pdf?src-supplier=TDK; ComponentLink2Description: https://datasheet.octopart.com:443/C0603X5R1A104K030BC-TDK-datasheet-151546523.pdf?src-supplier=TDK; ComponentLink3URL: https://datasheet.octopart.com:443/C0603X5R1A104K030BC-TDK-datasheet-41194876.pdf?src-supplier=element14+APAC; ComponentLink3Description: https://datasheet.octopart.com:443/C0603X5R1A104K030BC-TDK-datasheet-41194876.pdf?src-supplier=element14+APAC; ComponentLink4URL: https://datasheet.octopart.com:443/C0603X5R1A104K030BC-TDK-datasheet-41169347.pdf?src-supplier=element14+APAC; ComponentLink4Description: https://datasheet.octopart.com:443/C0603X5R1A104K030BC-TDK-datasheet-41169347.pdf?src-supplier=element14+APAC; ComponentLink5URL: https://datasheet.octopart.com:443/C0603X5R1A104K030BC-TDK-datasheet-82475248.pdf?src-supplier=Newark; ComponentLink5Description: https://datasheet.octopart.com:443/C0603X5R1A104K030BC-TDK-datasheet-82475248.pdf?src-supplier=Newark; ComponentLink6URL: https://datasheet.octopart.com:443/C0603X5R1A104K030BC-TDK-datasheet-13444418.pdf?src-supplier=Newark; ComponentLink6Description: https://datasheet.octopart.com:443/C0603X5R1A104K030BC-TDK-datasheet-13444418.pdf?src-supplier=Newark; ComponentLink7URL: https://datasheet.octopart.com:443/C0603X5R1A104K030BC-TDK-datasheet-23766614.pdf?src-supplier=Newark; ComponentLink7Description: https://datasheet.octopart.com:443/C0603X5R1A104K030BC-TDK-datasheet-23766614.pdf?src-supplier=Newark; ComponentLink8URL: https://datasheet.octopart.com:443/C0603X5R1A104K030BC-TDK-datasheet-175423548.pdf?src-supplier=TME; ComponentLink8Description: https://datasheet.octopart.com:443/C0603X5R1A104K030BC-TDK-datasheet-175423548.pdf?src-supplier=TME; ComponentLink9URL: https://datasheet.octopart.com:443/C0603X5R1A104K030BC-TDK-datasheet-182135025.pdf?src-supplier=TME; ComponentLink9Description: https://datasheet.octopart.com:443/C0603X5R1A104K030BC-TDK-datasheet-182135025.pdf?src-supplier=TME; ComponentLink10URL: https://datasheet.octopart.com:443/C0603X5R1A104K030BC-TDK-datasheet-159617022.pdf?src-supplier=TME; ComponentLink10Description: https://datasheet.octopart.com:443/C0603X5R1A104K030BC-TDK-datasheet-159617022.pdf?src-supplier=TME; ComponentLink11URL: https://datasheet.octopart.com:443/C0603X5R1A104K030BC-TDK-datasheet-12509848.pdf?src-supplier=Future+Electronics; ComponentLink11Description: https://datasheet.octopart.com:443/C0603X5R1A104K030BC-TDK-datasheet-12509848.pdf?src-supplier=Future+Electronics; ComponentLink12URL: https://datasheet.octopart.com:443/C0603X5R1A104K030BC-TDK-datasheet-10978788.pdf?src-supplier=Future+Electronics; ComponentLink12Description: https://datasheet.octopart.com:443/C0603X5R1A104K030BC-TDK-datasheet-10978788.pdf?src-supplier=Future+Electronics; ComponentLink13URL: https://datasheet.octopart.com:443/C0603X5R1A104K030BC-TDK-datasheet-8852320.pdf?src-supplier=Future+Electronics; ComponentLink13Description: https://datasheet.octopart.com:443/C0603X5R1A104K030BC-TDK-datasheet-8852320.pdf?src-supplier=Future+Electronics; ComponentLink14URL: https://datasheet.octopart.com:443/C0603X5R1A104K030BC-TDK-datasheet-8359770.pdf?src-supplier=Future+Electronics; ComponentLink14Description: https://datasheet.octopart.com:443/C0603X5R1A104K030BC-TDK-datasheet-8359770.pdf?src-supplier=Future+Electronics; ComponentLink15URL: https://datasheet.octopart.com:443/C0603X5R1A104K030BC-TDK-datasheet-8324322.pdf?src-supplier=Future+Electronics; ComponentLink15Description: https://datasheet.octopart.com:443/C0603X5R1A104K030BC-TDK-datasheet-8324322.pdf?src-supplier=Future+Electronics; ComponentLink16URL: https://datasheet.octopart.com:443/C0603X5R1A104K030BC-TDK-datasheet-128946.pdf?src-supplier=Future+Electronics; ComponentLink16Description: https://datasheet.octopart.com:443/C0603X5R1A104K030BC-TDK-datasheet-128946.pdf?src-supplier=Future+Electronics; ComponentLink17URL: https://datasheet.octopart.com:443/C0603X5R1A104K030BC-TDK-datasheet-62111717.pdf?src-supplier=Electro+Sonic; ComponentLink17Description: https://datasheet.octopart.com:443/C0603X5R1A104K030BC-TDK-datasheet-62111717.pdf?src-supplier=Electro+Sonic; ComponentLink18URL: https://datasheet.octopart.com:443/C0603X5R1A104K030BC-TDK-datasheet-154799455.pdf?src-supplier=Master+Electronics; ComponentLink18Description: https://datasheet.octopart.com:443/C0603X5R1A104K030BC-TDK-datasheet-154799455.pdf?src-supplier=Master+Electronics
C32 = GRM155R71A104KA01D: 10V 100nF X7R ±10% 0402 Multilayer Ceramic Capacitors MLCC - SMD/SMT ROHS; Manufacturer: Murata; Manufacturer Lifecycle Status: NRND; Dissipation Factor: 0.035%; Supplier: Farnell; Supplier Part Number: GRM155R71A104KA01D; Manufacturer Part Number: GRM155R71A104KA01D; RoHS: Compliant; Category: Ceramic Capacitors; Stock: 200000; Pricing: 10000=0,0029 (EUR); Case/Package: 0402; Case Code (Imperial): 0402; Case Code (Metric): 1005; Country of Origin: Japan, Mainland China, Philippines, Singapore, Thailand; Depth: 500µm; Dielectric: X7R; Dielectric Material: Ceramic; Export Control Classification Number (ECCN) Code: EAR99; Height: 500µm; Harmonized Tariff Schedule (HTS) Code: 8532.24.00.20; Introduction Date: 2004-11-19; Lead Free: Lead Free; Length: 1mm; Lifecycle Status: NRND; Material: Ceramic; Max Operating Temperature: 125°C; Min Operating Temperature: -55°C; Mounting Technology: Surface Mount; Pins: 2; Number of Terminals: 2; Packaging: Cut Tape; Radiation Hardening: No; REACH SVHC: Yes; Schedule B: 8532240020, 8532240020|8532240020, 8532240020|8532240020|8532240020, 8532240020|8532240020|8532240020|8532240020; Termination: SMD/SMT; Thickness: 500µm; Tolerance: 10%; Voltage: 10V; Voltage Rating: 10V; Voltage Rating (DC): 10V; Width: 500µm; ComponentLink1URL: https://datasheet.octopart.com:443/GRM155R71A104KA01D-Murata-datasheet-62317114.pdf?src-supplier=element14+APAC; ComponentLink1Description: https://datasheet.octopart.com:443/GRM155R71A104KA01D-Murata-datasheet-62317114.pdf?src-supplier=element14+APAC; ComponentLink2URL: https://datasheet.octopart.com:443/GRM155R71A104KA01D-Murata-datasheet-17853094.pdf?src-supplier=element14+APAC; ComponentLink2Description: https://datasheet.octopart.com:443/GRM155R71A104KA01D-Murata-datasheet-17853094.pdf?src-supplier=element14+APAC; ComponentLink3URL: https://datasheet.octopart.com/GRM155R71A104KA01D-Murata-datasheet-12515295.pdf; ComponentLink3Description: https://datasheet.octopart.com/GRM155R71A104KA01D-Murata-datasheet-12515295.pdf; ComponentLink4URL: https://datasheet.octopart.com/GRM155R71A104KA01D-Murata-datasheet-12510076.pdf; ComponentLink4Description: https://datasheet.octopart.com/GRM155R71A104KA01D-Murata-datasheet-12510076.pdf; ComponentLink5URL: https://datasheet.octopart.com/GRM155R71A104KA01D-Murata-datasheet-11978611.pdf; ComponentLink5Description: https://datasheet.octopart.com/GRM155R71A104KA01D-Murata-datasheet-11978611.pdf; ComponentLink6URL: https://datasheet.octopart.com/GRM155R71A104KA01D-Murata-datasheet-10025737.pdf; ComponentLink6Description: https://datasheet.octopart.com/GRM155R71A104KA01D-Murata-datasheet-10025737.pdf; ComponentLink7URL: https://datasheet.octopart.com/GRM155R71A104KA01D-Murata-datasheet-8819587.pdf; ComponentLink7Description: https://datasheet.octopart.com/GRM155R71A104KA01D-Murata-datasheet-8819587.pdf; ComponentLink8URL: https://datasheet.octopart.com/GRM155R71A104KA01D-Murata-datasheet-14400553.pdf; ComponentLink8Description: https://datasheet.octopart.com/GRM155R71A104KA01D-Murata-datasheet-14400553.pdf; ComponentLink9URL: https://datasheet.octopart.com:443/GRM155R71A104KA01D-Murata-datasheet-8817987.pdf?src-supplier=Newark; ComponentLink9Description: https://datasheet.octopart.com:443/GRM155R71A104KA01D-Murata-datasheet-8817987.pdf?src-supplier=Newark; ComponentLink10URL: https://datasheet.octopart.com:443/GRM155R71A104KA01D-Murata-datasheet-141266224.pdf?src-supplier=Ciiva; ComponentLink10Description: https://datasheet.octopart.com:443/GRM155R71A104KA01D-Murata-datasheet-141266224.pdf?src-supplier=Ciiva; ComponentLink11URL: https://datasheet.octopart.com:443/GRM155R71A104KA01D-Murata-datasheet-140690910.pdf?src-supplier=Ciiva; ComponentLink11Description: https://datasheet.octopart.com:443/GRM155R71A104KA01D-Murata-datasheet-140690910.pdf?src-supplier=Ciiva; ComponentLink12URL: https://datasheet.octopart.com:443/GRM155R71A104KA01D-Murata-datasheet-138740856.pdf?src-supplier=Ciiva; ComponentLink12Description: https://datasheet.octopart.com:443/GRM155R71A104KA01D-Murata-datasheet-138740856.pdf?src-supplier=Ciiva; ComponentLink13URL: https://datasheet.octopart.com:443/GRM155R71A104KA01D-Murata-datasheet-81455577.pdf?src-supplier=TME; ComponentLink13Description: https://datasheet.octopart.com:443/GRM155R71A104KA01D-Murata-datasheet-81455577.pdf?src-supplier=TME; ComponentLink14URL: https://datasheet.octopart.com:443/GRM155R71A104KA01D-Murata-datasheet-22122223.pdf?src-supplier=Future+Electronics; ComponentLink14Description: https://datasheet.octopart.com:443/GRM155R71A104KA01D-Murata-datasheet-22122223.pdf?src-supplier=Future+Electronics; ComponentLink15URL: https://datasheet.octopart.com:443/GRM155R71A104KA01D-Murata-datasheet-11966204.pdf?src-supplier=Arrow+Electronics; ComponentLink15Description: https://datasheet.octopart.com:443/GRM155R71A104KA01D-Murata-datasheet-11966204.pdf?src-supplier=Arrow+Electronics; ComponentLink16URL: https://datasheet.octopart.com:443/GRM155R71A104KA01D-Murata-datasheet-7576002.pdf?src-supplier=Jameco; ComponentLink16Description: https://datasheet.octopart.com:443/GRM155R71A104KA01D-Murata-datasheet-7576002.pdf?src-supplier=Jameco; ComponentLink17URL: https://datasheet.octopart.com:443/GRM155R71A104KA01D-Murata-datasheet-8326030.pdf?src-supplier=_legacy+Avnet; ComponentLink17Description: https://datasheet.octopart.com:443/GRM155R71A104KA01D-Murata-datasheet-8326030.pdf?src-supplier=_legacy+Avnet; ComponentLink18URL: https://datasheet.octopart.com:443/GRM155R71A104KA01D-Murata-datasheet-148211.pdf?src-supplier=Garrett; ComponentLink18Description: https://datasheet.octopart.com:443/GRM155R71A104KA01D-Murata-datasheet-148211.pdf?src-supplier=Garrett; ComponentLink19URL: http://sigma.octopart.com:80/reach_statement/Murata-company-16.pdf?src-supplier=Compliance+Statements; ComponentLink19Description: http://sigma.octopart.com:80/reach_statement/Murata-company-16.pdf?src-supplier=Compliance+Statements